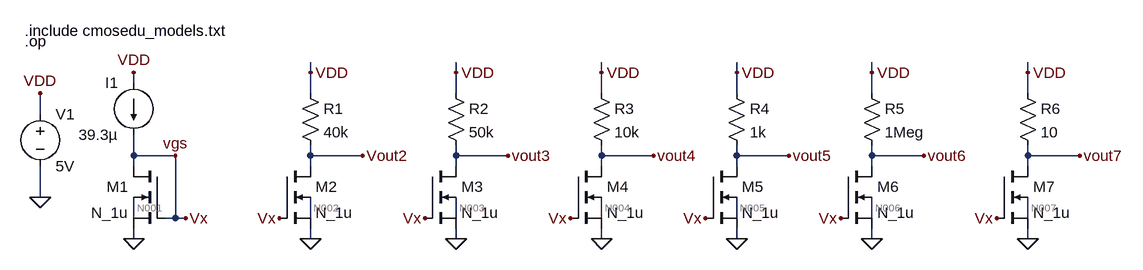
[diagram p0: schematic Circuito-7.asc]
Circuito-7.asc, the LTspice schematic file:
Version 4
SHEET 1 1708 680
WIRE 464 -64 464 -80
WIRE 688 -64 688 -80
WIRE 912 -64 912 -80
WIRE 1120 -64 1120 -80
WIRE 1328 -64 1328 -80
WIRE 1568 -64 1568 -80
WIRE 192 -48 192 -64
WIRE 464 -48 464 -64
WIRE 464 -32 464 -48
WIRE 688 -32 688 -64
WIRE 912 -32 912 -64
WIRE 1120 -32 1120 -64
WIRE 1328 -32 1328 -64
WIRE 1568 -32 1568 -64
WIRE 48 0 48 -32
WIRE 192 64 192 32
WIRE 256 64 192 64
WIRE 464 64 464 48
WIRE 544 64 464 64
WIRE 688 64 688 48
WIRE 768 64 688 64
WIRE 912 64 912 48
WIRE 992 64 912 64
WIRE 1120 64 1120 48
WIRE 1200 64 1120 64
WIRE 1328 64 1328 48
WIRE 1408 64 1328 64
WIRE 1568 64 1568 48
WIRE 1648 64 1568 64
WIRE 192 80 192 64
WIRE 464 80 464 64
WIRE 688 80 688 64
WIRE 912 80 912 64
WIRE 1120 80 1120 64
WIRE 1328 80 1328 64
WIRE 1568 80 1568 64
WIRE 48 128 48 80
WIRE 192 160 192 128
WIRE 256 160 256 64
WIRE 256 160 240 160
WIRE 272 160 256 160
WIRE 464 160 464 128
WIRE 688 160 688 128
WIRE 912 160 912 128
WIRE 1120 160 1120 128
WIRE 1328 160 1328 128
WIRE 1568 160 1568 128
WIRE 192 192 192 176
WIRE 464 192 464 176
WIRE 688 192 688 176
WIRE 912 192 912 176
WIRE 1120 192 1120 176
WIRE 1328 192 1328 176
WIRE 1568 192 1568 176
FLAG 48 128 0
FLAG 192 192 0
FLAG 256 64 vgs
FLAG 48 -32 VDD
FLAG 192 -64 VDD
FLAG 464 192 0
FLAG 544 64 Vout2
FLAG 464 -64 VDD
FLAG 688 192 0
FLAG 768 64 vout3
FLAG 688 -64 VDD
FLAG 912 192 0
FLAG 992 64 vout4
FLAG 912 -64 VDD
FLAG 272 160 Vx
FLAG 416 160 Vx
FLAG 640 160 Vx
FLAG 864 160 Vx
FLAG 1120 192 0
FLAG 1200 64 vout5
FLAG 1120 -64 VDD
FLAG 1072 160 Vx
FLAG 1328 192 0
FLAG 1408 64 vout6
FLAG 1328 -64 VDD
FLAG 1280 160 Vx
FLAG 1568 192 0
FLAG 1648 64 vout7
FLAG 1568 -64 VDD
FLAG 1520 160 Vx
DATAFLAG 464 -48 ""
SYMBOL voltage 48 -16 R0
WINDOW 123 0 0 Left 2
WINDOW 39 0 0 Left 2
SYMATTR InstName V1
SYMATTR Value 5V
SYMBOL nmos4 240 80 M0
SYMATTR InstName M1
SYMATTR Value N_1u
SYMATTR Value2 l=1.5u w=3u
SYMBOL current 192 -48 M0
WINDOW 123 0 0 Left 2
WINDOW 39 0 0 Left 2
SYMATTR InstName I1
SYMATTR Value 39.3µ
SYMBOL nmos4 416 80 R0
SYMATTR InstName M2
SYMATTR Value N_1u
SYMATTR Value2 l=1.5u w=6u
SYMBOL nmos4 640 80 R0
SYMATTR InstName M3
SYMATTR Value N_1u
SYMATTR Value2 l=1.5u w=6u
SYMBOL nmos4 864 80 R0
SYMATTR InstName M4
SYMATTR Value N_1u
SYMATTR Value2 l=1.5u w=6u
SYMBOL res 448 -48 R0
SYMATTR InstName R1
SYMATTR Value 40k
SYMBOL res 672 -48 R0
SYMATTR InstName R2
SYMATTR Value 50k
SYMBOL res 896 -48 R0
SYMATTR InstName R3
SYMATTR Value 10k
SYMBOL nmos4 1072 80 R0
SYMATTR InstName M5
SYMATTR Value N_1u
SYMATTR Value2 l=1.5u w=6u
SYMBOL res 1104 -48 R0
SYMATTR InstName R4
SYMATTR Value 1k
SYMBOL nmos4 1280 80 R0
SYMATTR InstName M6
SYMATTR Value N_1u
SYMATTR Value2 l=1.5u w=6u
SYMBOL res 1312 -48 R0
SYMATTR InstName R5
SYMATTR Value 1Meg
SYMBOL nmos4 1520 80 R0
SYMATTR InstName M7
SYMATTR Value N_1u
SYMATTR Value2 l=1.5u w=6u
SYMBOL res 1552 -48 R0
SYMATTR InstName R6
SYMATTR Value 10
TEXT 24 -128 Left 2 !.include cmosedu_models.txt
TEXT 24 -112 Left 2 !.op

The netlist it stands for:
* Circuito-7.asc
V1 VDD 0 5V
M1 Vx Vx 0 N001 N_1u l=1.5u w=3u
I1 VDD Vx 39.3µ
M2 Vout2 Vx 0 N002 N_1u l=1.5u w=6u
M3 vout3 Vx 0 N003 N_1u l=1.5u w=6u
M4 vout4 Vx 0 N004 N_1u l=1.5u w=6u
R1 VDD Vout2 40k
R2 VDD vout3 50k
R3 VDD vout4 10k
M5 vout5 Vx 0 N005 N_1u l=1.5u w=6u
R4 VDD vout5 1k
M6 vout6 Vx 0 N006 N_1u l=1.5u w=6u
R5 VDD vout6 1Meg
M7 vout7 Vx 0 N007 N_1u l=1.5u w=6u
R6 VDD vout7 10
.model NMOS NMOS
.model PMOS PMOS
.lib standard.mos
.include cmosedu_models.txt
.op
.backanno
.end

* Results of the author's LTspice run, read from the files saved beside the schematic
* Operating Point:
*   V(vdd) = 5 V
*   V(vx) = 1.464 V
*   V(n001) = 124.6 mV
*   V(vout2) = 1.512 V
*   V(n002) = 125.5 mV
*   V(vout3) = 783.5 mV
*   V(n003) = 105.6 mV
*   V(vout4) = 4.074 V
*   V(n004) = 153.6 mV
*   V(vout5) = 4.906 V
*   V(n005) = 158.6 mV
*   V(vout6) = 14.7 mV
*   V(n006) = 7.058 mV
*   V(vout7) = 4.999 V
*   V(n007) = 159.1 mV
*   Id(M7) = 93.98 µA
*   Ig(M7) = 0 A
*   Ib(M7) = 0 A
*   Is(M7) = -93.98 µA
*   Id(M6) = 4.985 µA
*   Ig(M6) = 0 A
*   Ib(M6) = 0 A
*   Is(M6) = -4.985 µA
*   Id(M5) = 93.85 µA
*   Ig(M5) = 0 A
*   Ib(M5) = 0 A
*   Is(M5) = -93.85 µA
*   Id(M4) = 92.58 µA
*   Ig(M4) = 0 A
*   Ib(M4) = 0 A
*   Is(M4) = -92.58 µA
*   Id(M3) = 84.33 µA
*   Ig(M3) = 0 A
*   Ib(M3) = 0 A
*   Is(M3) = -84.33 µA
*   Id(M2) = 87.2 µA
*   Ig(M2) = 0 A
*   Ib(M2) = 0 A
*   Is(M2) = -87.2 µA
*   Id(M1) = 39.3 µA
*   Ig(M1) = 0 A
*   Ib(M1) = 0 A
*   Is(M1) = -39.3 µA
*   I(I1) = 39.3 µA
*   I(R6) = 93.98 µA
*   I(R5) = 4.985 µA
*   I(R4) = 93.85 µA
*   I(R3) = 92.58 µA
*   I(R2) = 84.33 µA
*   I(R1) = 87.2 µA
*   I(V1) = -496.2 µA
* From the log:
*   Semiconductor Device Operating Points:
*                           --- MOSFET Transistors ---
*   Name:          m7          m6          m5          m4          m3
*   Model:        n_1u        n_1u        n_1u        n_1u        n_1u
*   Id:          9.40e-05    4.99e-06    9.38e-05    9.26e-05    8.43e-05
*   Vgs:         1.46e+00    1.46e+00    1.46e+00    1.46e+00    1.46e+00
*   Vds:         5.00e+00    1.47e-02    4.91e+00    4.07e+00    7.83e-01
*   Vbs:         1.59e-01    7.06e-03    1.59e-01    1.54e-01    1.06e-01
*   Vth:         8.14e-01    8.55e-01    8.14e-01    8.15e-01    8.27e-01
*   Vdsat:       5.10e-01    4.89e-01    5.10e-01    5.09e-01    5.03e-01
*   Gm:          2.27e-04    7.12e-06    2.27e-04    2.24e-04    2.06e-04
*   Gds:         9.60e-06    3.32e-04    9.59e-06    9.57e-06    1.10e-05
*   Gmb:         5.47e-05    2.29e-06    5.46e-05    5.43e-05    5.29e-05
*   Cbd:         0.00e+00    0.00e+00    0.00e+00    0.00e+00    0.00e+00
*   Cbs:         0.00e+00    0.00e+00    0.00e+00    0.00e+00    0.00e+00
*   Cgsov:       1.20e-15    1.20e-15    1.20e-15    1.20e-15    1.20e-15
*   Cgdov:       1.20e-15    1.20e-15    1.20e-15    1.20e-15    1.20e-15
*   Cgbov:       1.30e-16    1.30e-16    1.30e-16    1.30e-16    1.30e-16
*   Cgs:         8.98e-15    6.80e-15    8.98e-15    8.98e-15    8.98e-15
*   Cgd:         0.00e+00    6.66e-15    0.00e+00    0.00e+00    0.00e+00
*   Cgb:         0.00e+00    0.00e+00    0.00e+00    0.00e+00    0.00e+00
*   Name:          m2          m1
*   Model:        n_1u        n_1u
*   Id:          8.72e-05    3.93e-05
*   Vgs:         1.46e+00    1.46e+00
*   Vds:         1.51e+00    1.46e+00
*   Vbs:         1.26e-01    1.25e-01
*   Vth:         8.22e-01    8.51e-01
*   Vdsat:       5.06e-01    4.72e-01
*   Gm:          2.13e-04    1.01e-04
*   Gds:         9.88e-06    4.28e-06
*   Gmb:         5.32e-05    3.03e-05
*   Cbd:         0.00e+00    0.00e+00
*   Cbs:         0.00e+00    0.00e+00
*   Cgsov:       1.20e-15    6.00e-16
*   Cgdov:       1.20e-15    6.00e-16
*   Cgbov:       1.30e-16    1.30e-16
*   Cgs:         8.98e-15    4.49e-15
*   Cgd:         0.00e+00    0.00e+00
*   Cgb:         0.00e+00    0.00e+00